# Altium schematic sheet 12Vin_to_3V3_LDO.SchDoc
size A4
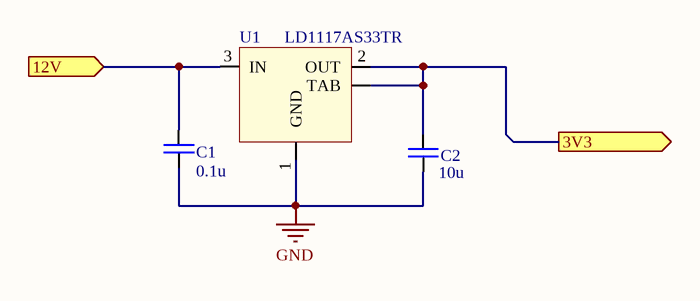
[diagram p0: 12Vin_to_3V3_LDO.SchDoc]

## Parts
C1  value 0.1u  [C0402]  (hidden comment: Конденсатор SMD, 0.1мкФ, X7R, 25В, 10%, 0402)
C2  value 10u  [C0805]  (hidden comment: Конденсатор SMD, 10мкФ, X7R, 16В, 10%, 0805)
U1  Микросхема, LD1117AS33TR  [SOT223]  (value not drawn)

## Ports
3V3 (out), 12V (in)

## Nets
GND: C1.2 C2.2 U1.1(GND)
3V3: C2.1 U1.2(OUT) U1.4(TAB) ; port 3V3
12V: C1.1 U1.3(IN) ; port 12V

## Library data of the parts
C1 = C0402: Chip Capacitor 0402; Assembly: 0.1u_X7R_25V_10%_0402; Voltage_assembly: 25V; Voltage: 25В; Tolerance: 10%; TemperatureCoeff: X7R; Family: Конденсатор SMD; Capacitance: 0.1мкФ; Package: 0402
C2 = C0805: Chip Capacitor 0805; Assembly: 10u_X7R_16V_10%_0805; Voltage_assembly: 16V; Voltage: 16В; Tolerance: 10%; TemperatureCoeff: X7R; Family: Конденсатор SMD; Package: 0805; Capacitance: 10мкФ
U1 = LD1117AS33TR: 0.8-A, Positive Fixed-Voltage, Low-Dropout Regulator; Manufacturer: ST Microelectronics; Family: Микросхема; Package: SOT223; Assembly: LD1117AS33TR; PartNumber: LD1117AS33TR